# Altium schematic sheet Step_Down.SchDoc
size A4
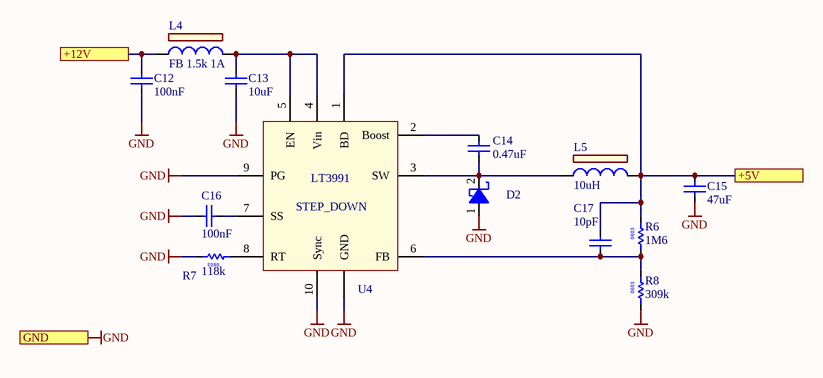
[diagram p0: Step_Down.SchDoc]

## Parts
C12  100nF  [C0603V]
C13  10uF  [CAPC3216N]
C14  0.47uF  [CAPC2012N]
C15  47uF  [CAPC2012N]
C16  100nF  [C0603V]
C17  10pF  [CAPC1608N]
D2  PMEG3010ER  [SOD123]  (value not drawn)
L4  FB 1.5k 1A  [LL0805\2P]
L5  10uH  [L1515]
R6  1M6  [RESC1608N]
R7  118k  [RESC1608X50N]
R8  309k  [RESC1608X50N]
U4  LT3991  [10-LEAD PLASTIC MSOP - duplicate]  (value not drawn)

## Ports
+5V, +12V, GND

## Nets
GND: C12.1 C13.2 C15.1 C16.1 D2.1(ANODE) R7.2 R8.1 U4.9(PG) U4.10(Sync) U4.GND ; port GND
+5V: C15.2 C17.2 L5.2 R6.2 U4.1(BD) ; port +5V
+12V: C12.2 L4.1 ; port +12V
NetC13_1: C13.1 L4.2 U4.4(Vin) U4.5(EN)
NetC14_1: C14.1 D2.2(CATHODE) L5.1 U4.3(SW)
NetC14_2: C14.2 U4.2(Boost)
NetC16_2: C16.2 U4.7(SS)
NetC17_1: C17.1 R6.1 R8.2 U4.6(FB)
NetR7_1: R7.1 U4.8(RT)

## Notes on the sheet
- (in symbol LT3991) STEP_DOWN
- (in symbol R0000563) 0603
- (in symbol R0000610) 0603
- (in symbol R2406149) 0603

## Library data of the parts
C12 C16 = C0000005: MLCC, 0.1uF 16V 10% X7R 0603; Manufacturer: KEMET; Manufacturer Part Number: C0603C104K4RACTU; Voltage: 16; Project: AUT-RX03-00; Note: 0,041 €; Part Number: C0000005; Part Type: MLCC; Tolerance: 10%; Material: X7R; Package: 0603 (1608 metric); SMD: Yes; Supplier 1: Farnell; Supplier Part Number 1: 1414610RL; Supplier 2: Mouser; Supplier Part Number 2: 80-C0603C104K4R; ComponentLink1Description: MFG link; ComponentLink1URL: http://www.kemet.com/datasheets&C0603C104K4RACTU; Data: 2011.02.27
C13 = C0000006: MLCC, 10uF, 16V, 10%, 1206; Manufacturer: MURATA; Manufacturer Part Number: GRM31CR71C106KAC7L; Voltage: 16; Material: X7R; Project: AUT-RX03-00; Note: 1,53 €; Part Number: C0000006; Part Type: MLCC; Tolerance: ±10%; Package: 1206 (3216 metric); SMD: Yes; Supplier 1: Farnell; Supplier Part Number 1: 1845772; Supplier 2: Mouser; Supplier Part Number 2: 81-GRM31CR71C106KAC7; ComponentLink1Description: MFG link; ComponentLink1URL: http://search.murata.co.jp/Ceramy/image/img/PDF/ENG/GRM31CR71C106KAC7.pdf; Data: 2011.02.27
C14 = C0000094: MLCC,0.47uF,50V, 0805,; Manufacturer: MURATA; Manufacturer Part Number: GRM219R60J106KE19D; Voltage: 50; Tolerance: ±10%; Material: X5R; Project: FPGA system; Note: S; Part Number: C0000094; Part Type: MLCC; Package: 0805 (2012 metric); SMD: Yes; Supplier 1: Farnell; Supplier Part Number 1: 1845738; ComponentLink1Description: MFG link; Data: 2013.04.12
C15 = C0000094: MLCC,47uF,50V, 0805,; Manufacturer: MURATA; Manufacturer Part Number: GRM219R60J106KE19D; Voltage: 50; Tolerance: ±10%; Material: X5R; Project: FPGA system; Note: S; Part Number: C0000094; Part Type: MLCC; Package: 0805 (2012 metric); SMD: Yes; Supplier 1: Farnell; Supplier Part Number 1: 1845738; ComponentLink1Description: MFG link; Data: 2013.04.12
C17 = C0000042: MLCC, 0603, NP0, 50V, 10PF; Manufacturer: MULTICOMP; Manufacturer Part Number: MCCA000192; Voltage: 100; Material: C0G / NP0; Project: Zhilinskas_I/II/III; Part Number: C0000042; Part Type: MLCC; Package: 0603 (1608 metric); SMD: Yes; Supplier 1: Farnell; Supplier Part Number 1: 1759053; Price: 0,02; MOQ: 100; Supplier 2: Mouser; Supplier Part Number 2: 77-VJ0603A100JXACBC; ComponentLink1Description: MFG link; ComponentLink1URL: http://www.farnell.com/datasheets/654515.pdf; Data: 2011.06.12
D2 = D0000058: 1A, 30V; Manufacturer: NXP; Vforvard: 360mV; Capacitance: 170pF; Part Number: D0000058; Part Type: Diode\Schottky; Reverse Voltage: 30V; Current: 1A; SMD: Yes; Manufacturer Part Number: PMEG3010ER; ComponentLink1Description: MFG link; ComponentLink1URL: http://www.nxp.com/documents/data_sheet/PMEG3010EP.pdf; Data: 2012.06.20; Supplier 1: SAMPLE
L4 = L0000004: BEAD FERRITE, SMD 1500OHM, 0805; Manufacturer: Wurth Elektronik; Manufacturer Part Number: 742792097; Resistance: 1500; Project: PSP500; Part Number: L0000004; Part Type: Ferrite\Bead; SMD: Yes; Supplier 1: Farnell; Supplier Part Number 1: 1635738; Supplier 2: Mouser; Supplier Part Number 2: 710-742792097; ComponentLink1Description: MFG link; ComponentLink1URL: http://katalog.we-online.de/kataloge/eisos/media/pdf/742792097.pdf; ComponentLink2Description: DataSheet; Data: 2011.02.01
L5 = L0000071: INDUCTOR, SMD, 4X4MM, 10UH, 20%; Manufacturer: Murata; Manufacturer Part Number: LQH44PN100MP0L; Resistance: 0.16; Current: 1.17; SRF: 25MHz; Part Number: L0000071; Part Type: Inductor\Power; Isat: 1.17; Tolerance: 20%; SMD: Yes; Supplier 1: Farnell; Supplier Part Number 1: 1782801; ComponentLink1Description: MFG link; ComponentLink2Description: DataSheet; Data: 2012.01.12
R6 = R2406149: 1M6 5% 0603 1/10W; R2408042: R2406149; Part type: Carbon Film; Tolerance: ±5%; Power: 1/10W; Package: 0603 (1608 metric); SMD: Yes; Data: 2011.01.31
R7 = R0000563: Res, 118K, 0603 (1608 metric), ±1%, 100mW, 75V; Manufacturer: PANASONIC; Manufacturer Part Number: ERJ3EKF1183V; R2408042: R0000563; Part type: Thick Film; Tolerance: ±1%; Power: 100mW; Package: 0603 (1608 metric); SMD: Yes; Supplier 1: Farnell; ComponentLink1Description: MFG link; ComponentLink1URL: http://www.farnell.com/datasheets/1678782.pdf; Data: 2015.09.15
R8 = R0000610: Res, 309K, 0603 (1608 metric), ±1%, 100mW, 75V; Manufacturer: PANASONIC; Manufacturer Part Number: ERJ3EKF3093V; R2408042: R0000610; Part type: Thick Film; Tolerance: ±1%; Power: 100mW; Package: 0603 (1608 metric); SMD: Yes; Supplier 1: Farnell; ComponentLink1Description: MFG link; ComponentLink1URL: http://www.farnell.com/datasheets/1678782.pdf; Data: 2015.09.15
U4 = LT3991: 55V, 1.2A Step-Down  Regulator with 2.8µA  Quiescent Current; Supplier 1: Newark; Supplier Part Number 1: 24T2758